# EAGLE design 6-30-10-9:32 (EAGLE 5.06)
AUTHOR: Josh Ashby; VERSION: 1.1
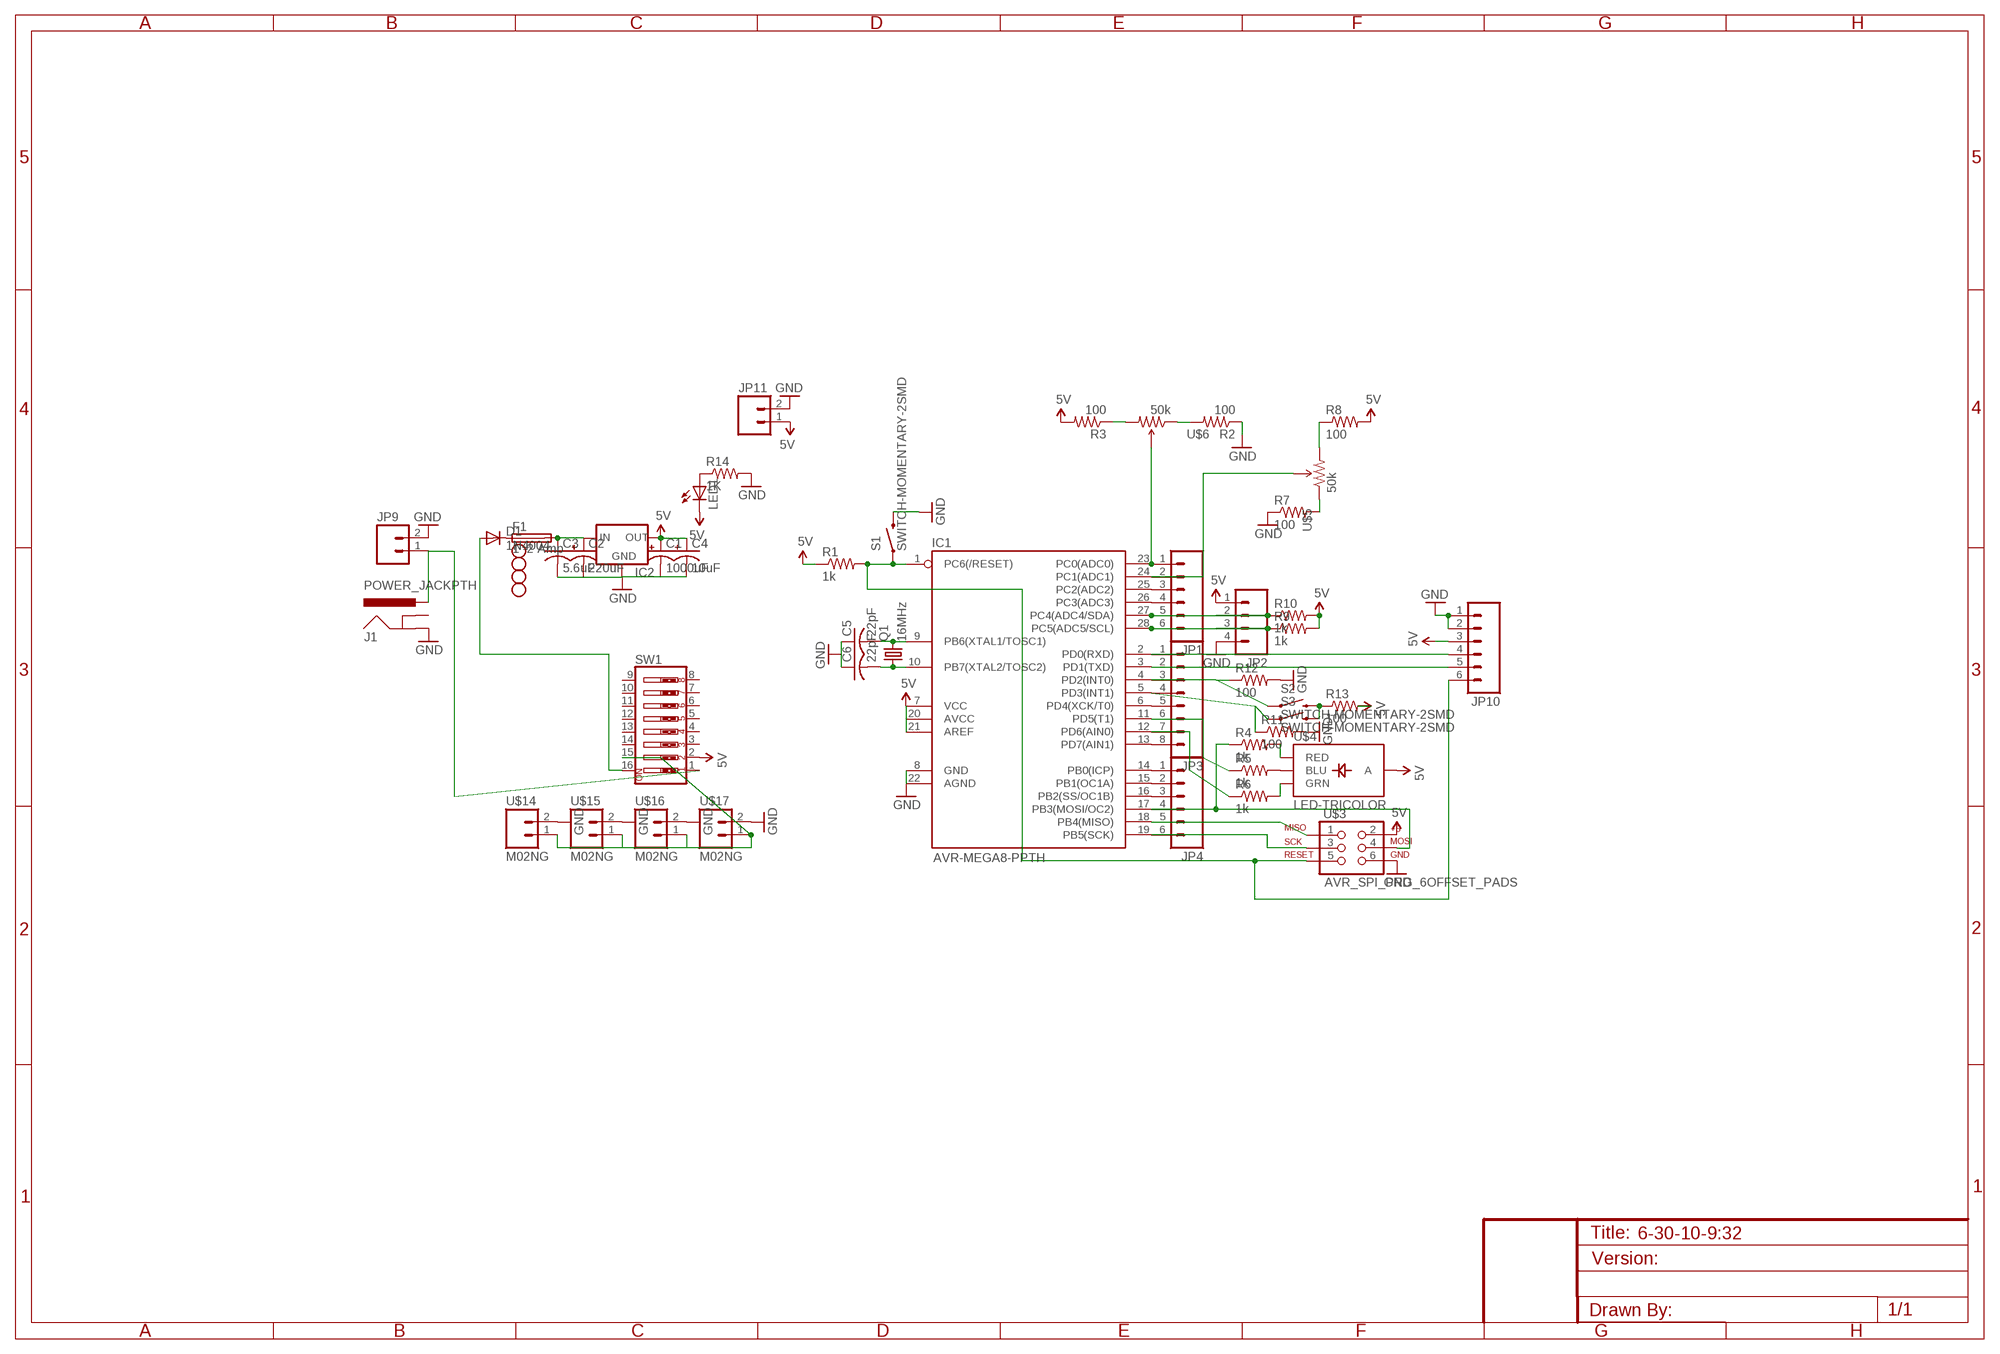
[diagram p0: schematic, sheet 1]

## Parts
C1  1000uF  CPOL-USE2.5-7  [E2,5-7]
C2  220uF  CPOL-USE5-10.5  [E5-10,5]
C3  5.6uF  C-US050-030X075  [C050-030X075]
C4  10uF  CPOL-USE2.5-5  [E2,5-5]
C5  22pF  C-US025-040X050  [C025-040X050]
C6  22pF  C-US025-040X050  [C025-040X050]
D1  1N4004  [DO41-10]
F1  1 -2 Amp  GSH15  [GSH15]
IC1  AVR-MEGA8-PPTH  [DIL28-3]
IC2  V_REG_78XXSIDE  [78XXL]
J1  POWER_JACKPTH  [POWER_JACK_PTH]
JP1  M06LOCK_LONGPADS  [1X06_LOCK_LONGPADS]
JP2  M04LOCK_LONGPADS  [1X04_LOCK_LONGPADS]
JP3  M08LOCK_LONGPADS  [1X08_LOCK_LONGPADS]
JP4  M06LOCK_LONGPADS  [1X06_LOCK_LONGPADS]
JP5  STAND-OFF  [STAND-OFF]
JP6  STAND-OFF  [STAND-OFF]
JP7  STAND-OFF  [STAND-OFF]
JP8  STAND-OFF  [STAND-OFF]
JP9  M025MM  [SCREWTERMINAL-5MM-2]
JP10  M06LOCK_LONGPADS  [1X06_LOCK_LONGPADS]
JP11  M025MM  [SCREWTERMINAL-5MM-2]
LED1  LED0603  [LED-0603]
Q1  16MHz  CRYSTALHC49UV  [HC49U-V]
R1  1k  RESISTOR0603-RES  [0603-RES]
R2  100  RESISTOR0603-RES  [0603-RES]
R3  100  RESISTOR0603-RES  [0603-RES]
R4  1k  RESISTOR0603-RES  [0603-RES]
R5  1k  RESISTOR0603-RES  [0603-RES]
R6  1k  RESISTOR0603-RES  [0603-RES]
R7  100  RESISTOR0603-RES  [0603-RES]
R8  100  RESISTOR0603-RES  [0603-RES]
R9  1k  RESISTOR0603-RES  [0603-RES]
R10  1k  RESISTOR0603-RES  [0603-RES]
R11  100  RESISTOR0603-RES  [0603-RES]
R12  100  RESISTOR0603-RES  [0603-RES]
R13  100  RESISTOR0603-RES  [0603-RES]
R14  1K  RESISTOR0603-RES  [0603-RES]
S1  SWITCH-MOMENTARY-2SMD  [TACTILE_SWITCH_SMD]
S2  SWITCH-MOMENTARY-2SMD  [TACTILE_SWITCH_SMD]
S3  SWITCH-MOMENTARY-2SMD  [TACTILE_SWITCH_SMD]
SW1  SW_DIP-8  [DIPSWITCH-08]
U$3  AVR_SPI_PRG_6OFFSET_PADS  [2X3_OFFSET]
U$4  LED-TRICOLOR  [LED-TRICOLOR-SMD]
U$5  50k  TRIMPOTTRIMPOT_PTH_S3_LOCK  [TRIMPOT_PTH_S3_LOCK]
U$6  50k  TRIMPOTTRIMPOT_PTH_S3_LOCK  [TRIMPOT_PTH_S3_LOCK]
U$14  M02NG  [1X02]
U$15  M02NG  [1X02]
U$16  M02NG  [1X02]
U$17  M02NG  [1X02]

## Nets
5V: C1.+ C4.+ IC1.7(VCC) IC1.20(AVCC) IC1.21(AREF) IC2.OUT JP2.1 JP10.3 JP11.1 LED1.C R1.1 R3.2 R8.2 R9.2 R10.2 R13.2 SW1.2 U$3.2 U$4.A
GND: C1.- C2.- C3.2 C4.- C5.1 C6.1 IC1.8(GND) IC1.22(AGND) IC2.GND J1.GND JP2.4 JP9.2 JP10.1 JP10.2 JP11.2 R2.1 R7.1 R11.2 R12.2 R14.2 S1.3 U$3.6 U$14.2 U$15.2 U$16.2 U$17.2
N$1: R5.2 U$4.B(BLU)
N$2: R6.2 U$4.G(GRN)
N$3: IC1.23(PC0(ADC0)) JP1.1 U$6.2(WIPER)
N$4: IC1.24(PC1(ADC1)) JP1.2 U$5.2(WIPER)
N$5: IC1.25(PC2(ADC2)) JP1.3
N$6: IC1.26(PC3(ADC3)) JP1.4
N$7: IC1.27(PC4(ADC4/SDA)) JP1.5 JP2.2 R10.1
N$8: IC1.28(PC5(ADC5/SCL)) JP1.6 JP2.3 R9.1
N$9: IC1.2(PD0(RXD)) JP3.1 JP10.4
N$10: IC1.3(PD1(TXD)) JP3.2 JP10.5
N$11: IC1.4(PD2(INT0)) JP3.3 R12.1 S2.1
N$12: IC1.5(PD3(INT1)) JP3.4 R11.1 S3.1
N$13: IC1.6(PD4(XCK/T0)) JP3.5
N$14: IC1.11(PD5(T1)) JP3.6 R5.1
N$15: IC1.12(PD6(AIN0)) JP3.7 R6.1
N$16: IC1.13(PD7(AIN1)) JP3.8
N$17: IC1.14(PB0(ICP)) JP4.1
N$18: IC1.15(PB1(OC1A)) JP4.2
N$19: IC1.16(PB2(SS/OC1B)) JP4.3
N$20: IC1.17(PB3(MOSI/OC2)) JP4.4 R4.1 U$3.4
N$21: IC1.18(PB4(MISO)) JP4.5 U$3.1
N$22: IC1.19(PB5(SCK)) JP4.6 U$3.3
N$23: IC1.1(PC6(/RESET)) JP10.6 R1.2 S1.1 U$3.5
N$24: R4.2 U$4.R(RED)
N$25: C6.2 IC1.10(PB7(XTAL2/TOSC2)) Q1.1
N$26: R2.2 U$6.1(CCW)
N$27: R3.1 U$6.3(CW)
N$28: R7.2 U$5.1(CCW)
N$29: R8.1 U$5.3(CW)
N$30: C5.2 IC1.9(PB6(XTAL1/TOSC1)) Q1.2
N$31: R13.1 S2.3 S3.3
N$32: C2.+ C3.1 F1.2 IC2.IN
N$33: J1.PWR JP9.1 SW1.1
N$34: D1.C F1.1
N$35: D1.A SW1.16
N$36: LED1.A R14.1
N$37: SW1.15 U$14.1 U$15.1 U$16.1 U$17.1
Unconnected: J1.GNDBREAK SW1.3 SW1.4 SW1.5 SW1.6 SW1.7 SW1.8 SW1.9 SW1.10 SW1.11 SW1.12 SW1.13 SW1.14

## Library data of the parts
C1 C2 C4 = rcl:CPOL-US: POLARIZED CAPACITOR, American symbol
C3 C5 C6 = rcl:C-US: CAPACITOR, American symbol
D1 = diode:1N4004: DIODE general purpose rectifier, 1 A
F1 = fuse:GSH15: FUSE HOLDER grid 15mm, 19649 Wickmann
IC1 = SparkFun:AVR-MEGA8-P: MICROCONTROLLER 8 Kbytes FLASH 1 kbytes SRAM 512 bytes EEPROM USART 4-channel 10 bit ADC 2-channel 8 bit ADC
IC2 = SparkFun:V_REG_78XX: Voltage Regulator Standard 7805 5V regulator. IGO (Input Ground Output). Spark Fun Electronics SKU : COM-00107
J1 = SparkFun:POWER_JACK: Power Jack This is the standard 5.5mm barrel jack for power. The PTH is the most common, proven, reliable, footprint. All others are experimental. The Slot footprint only works if the mill layer is transmitted to the PCB fab house so be warned. Spark Fun Electronics SKU : PRT-00119. Mating wall wart : TOL-00298 (and others)
JP1 JP4 JP10 = SparkFun:M06: Header 6 Standard 6-pin 0.1" header. Use with straight break away headers (SKU : PRT-00116), right angle break away headers (PRT-00553), swiss pins (PRT-00743), machine pins (PRT-00117), and female headers (PRT-00115). Molex polarized connector foot print use with SKU : PRT-08094 with associated crimp pins and housings. NOTES ON THE VARIANTS LOCK and LOCK_LONGPADS... This footprint was designed to help hold the alignment of a through-hole component (i.e. 6-pin header) while soldering it into place. You may notice that each hole has been shifted either up or down by 0.005 of an inch from it's more standard position (which is a perfectly straight line). This slight alteration caused the pins (the squares in the middle) to touch the edges of the holes. Because they are alternating, it causes a "brace" to hold the component in place. 0.005 has proven to be the perfect amount of "off-center" position when using our standard breakaway headers. Although looks a little odd when you look at the bare footprint, once you have a header in there, the alteration is very hard to notice. Also, if you push a header all the way into place, it is covered up entirely on the bottom side. This idea of altering the position of holes to aid alignment will be further integrated into the Sparkfun Library for other footprints. It can help hold any component with 3 or more connection pins.
JP2 = SparkFun:M04: Header 4 Standard 4-pin 0.1" header. Use with straight break away headers (SKU : PRT-00116), right angle break away headers (PRT-00553), swiss pins (PRT-00743), machine pins (PRT-00117), and female headers (PRT-00115). Molex polarized connector foot print use with SKU : PRT-08231 with associated crimp pins and housings.
JP3 = SparkFun:M08: Header 8 Standard 8-pin 0.1" header. Use with straight break away headers (SKU : PRT-00116), right angle break away headers (PRT-00553), swiss pins (PRT-00743), machine pins (PRT-00117), and female headers (PRT-00115).
JP5-JP8 = SparkFun:STAND-OFF: Stand Off This is the mechanical footprint for a #4 phillips button head screw. Use the keepout ring to avoid running the screw head into surrounding components. SKU : PRT-00447
JP9 JP11 = SparkFun:M02: Header 2 Standard 2-pin 0.1" header. Use with straight break away headers (SKU : PRT-00116), right angle break away headers (PRT-00553), swiss pins (PRT-00743), machine pins (PRT-00117), and female headers (PRT-00115). Molex polarized connector foot print use with SKU : PRT-08233 with associated crimp pins and housings.
LED1 = SparkFun:LED: LEDs Standard schematic elements and footprints for 5mm, 3mm, 1206, and 0603 sized LEDs. 5mm - Spark Fun Electronics SKU : COM-00529 (and others)
Q1 = SparkFun:CRYSTAL: Crystals Various standard crystals. Proven footprints. Spark Fun Electronics SKU : COM-00534
R1-R14 = SparkFun:RESISTOR: Resistor Basic schematic elements and footprints for 0603, 1206, and PTH 1/10th watt (small) resistors.
S1-S3 = SparkFun:SWITCH-MOMENTARY-2
SW1 = SparkFun:SW_DIP-8: DIP Switch 8 Position Spark Fun Electronics SKU : COM-08034
U$3 = SparkFun:AVR_SPI_PRG_6: AVR ISP 6 Pin This is the reduced ISP connector for AVR programming. Common on Arduino. This footprint will take up less PCB space and can be used with a 10-pin to 6-pin adapter such as SKU: BOB-08508
U$4 = SparkFun:LED-TRICOLOR: Tri-Color LED SMD Proven layout and schematic for triple color LED in SMD package - common anode. Spark Fun Electronics SKU : COM-07844
U$5 U$6 = SparkFun:TRIMPOT
U$14-U$17 = SparkFun:M02NG

## Board
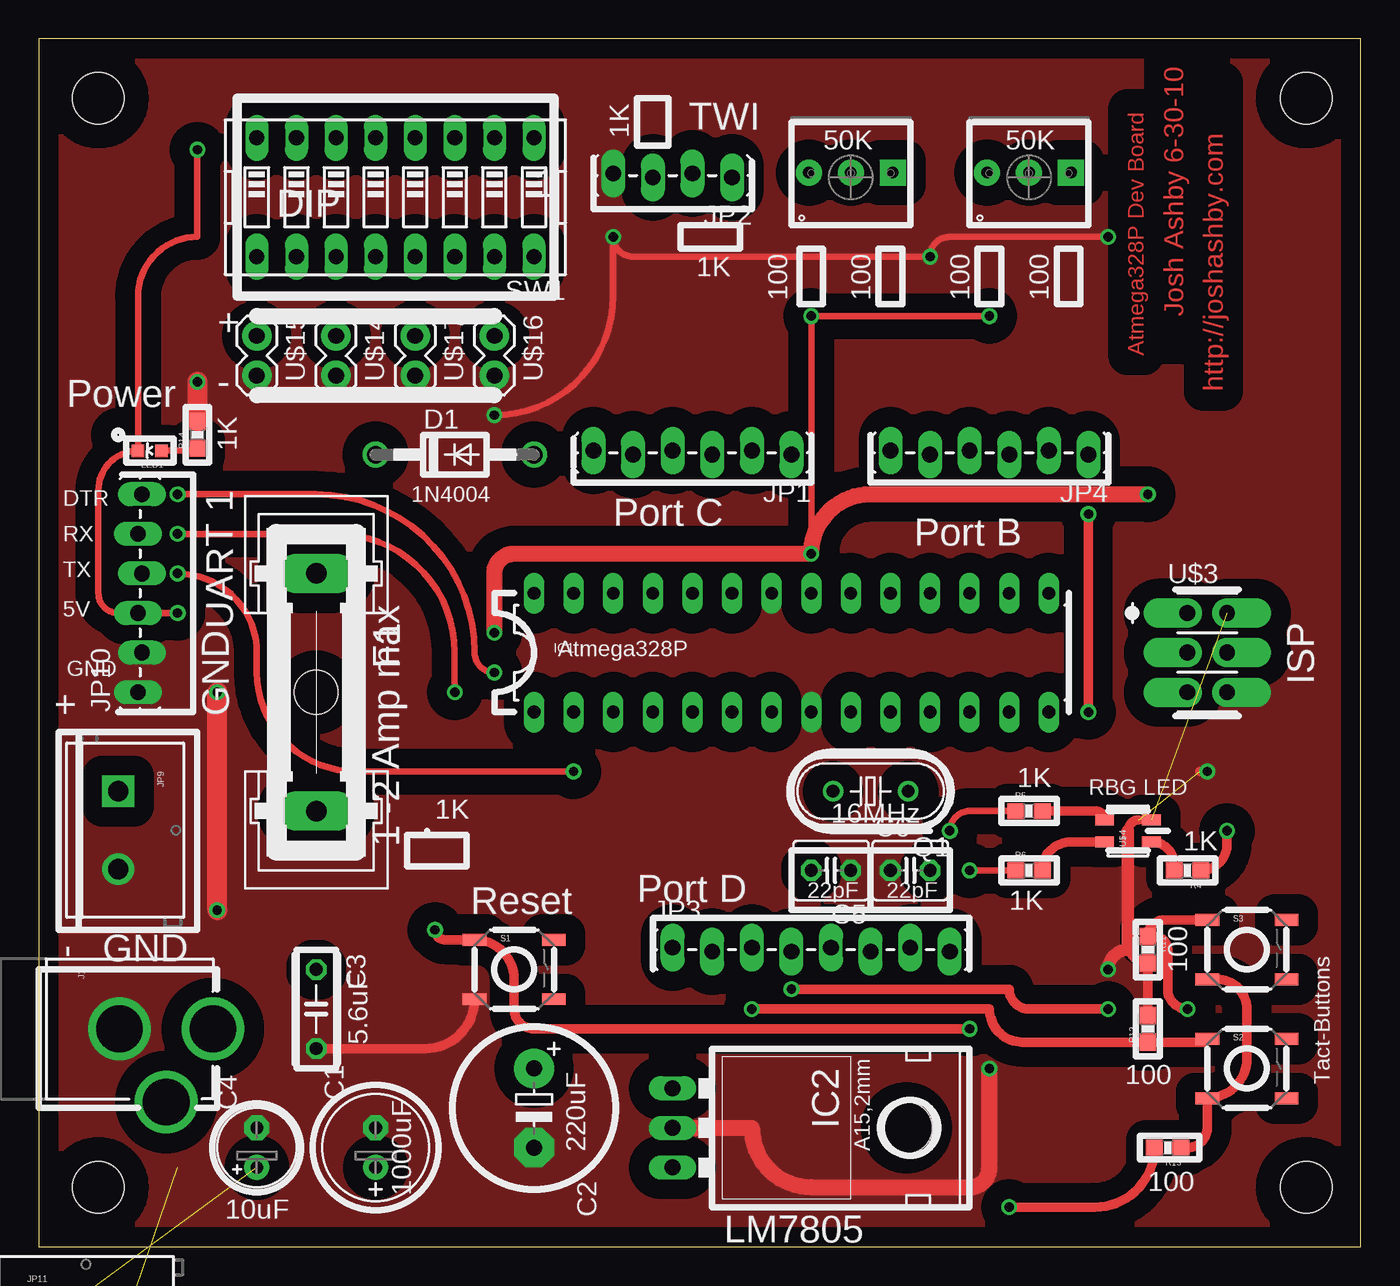
[diagram p1: board, top side]
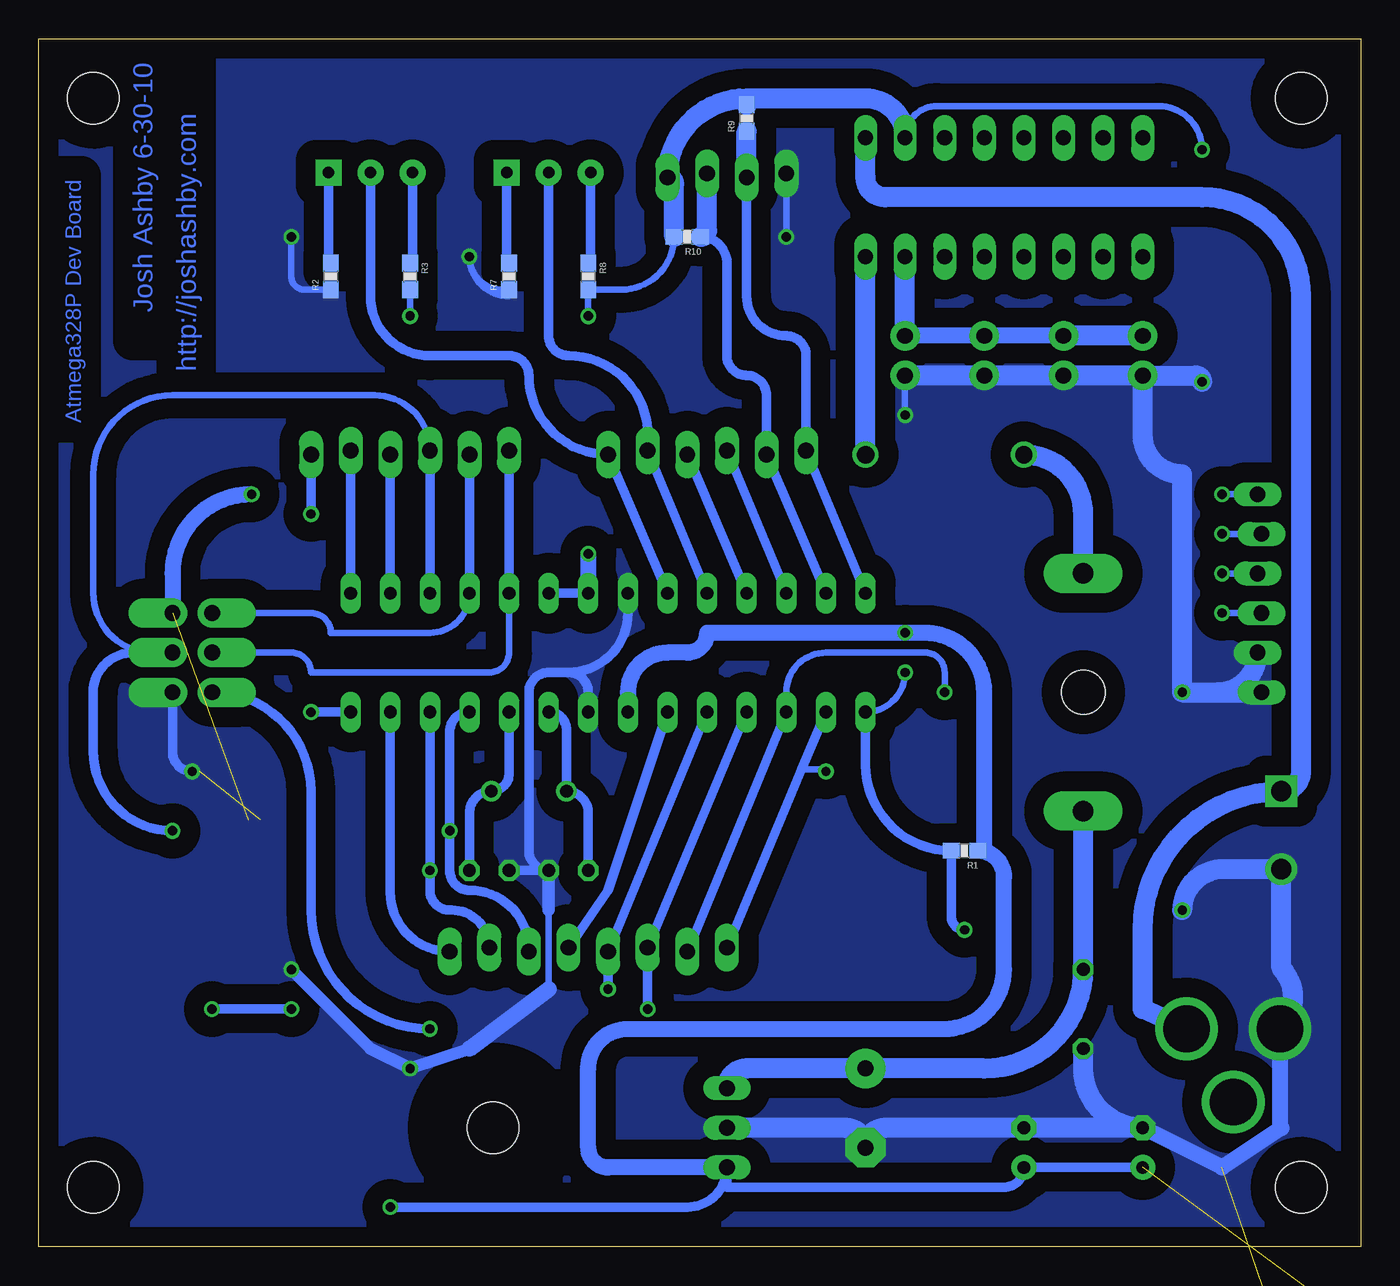
[diagram p2: board, bottom side, seen from below]

Size 84.76 x 77.46 mm. Coordinates in mm from the lower left corner, seen from the top.
Outline: 0,0 84.76,0 84.76,77.46 0,77.46 0,0
Copper layers (1*16): Top 0.035mm / dielectric 1.5mm / Bottom 0.035mm
Design rules "default *": minimum track width 10mil, minimum drill 6mil, track to track 8mil, track to pad 8mil, pad to pad 8mil, via to via 8mil, smd to smd 8mil, copper to edge 40mil, drill to drill 8mil, minimum pad ring 10mil, minimum via ring 8mil, stop-mask expansion 4mil, vias tented up to drill 0mil, thermal gap 10mil

### Footprints (pad centres in the part's own frame; a part is rotated, then mirrored left to right if it is on the bottom)
E2,5-7 = drill 0.813 pad 1.6 round: + -1.27,0 | drill 0.813 pad 1.6 octagon: - 1.27,0
E5-10,5 = drill 1.016 pad 2.54 round: + -2.54,0 | drill 1.016 pad 2.54 octagon: - 2.54,0
C050-030X075 = drill 0.813 octagon: 1 -2.54,0; 2 2.54,0
E2,5-5 = drill 0.813 pad 1.6 round: + -1.27,0 | drill 0.813 pad 1.6 octagon: - 1.27,0
C025-040X050 = drill 0.813 octagon: 1 -1.27,0; 2 1.27,0
DO41-10 = drill 1.118 round: A 5.08,0; C -5.08,0
GSH15 = drill 1.321 pad 2.54 long: 1 -7.62,0; 2 7.62,0 | hole 2.794: 0,0
DIL28-3 = drill 0.813 long: 1 -16.51,-3.81; 2 -13.97,-3.81; 3 -11.43,-3.81; 4 -8.89,-3.81; 5 -6.35,-3.81; 6 -3.81,-3.81; 7 -1.27,-3.81; 8 1.27,-3.81; 9 3.81,-3.81; 10 6.35,-3.81; 11 8.89,-3.81; 12 11.43,-3.81; 13 13.97,-3.81; 14 16.51,-3.81; 15 16.51,3.81; 16 13.97,3.81; 17 11.43,3.81; 18 8.89,3.81; 19 6.35,3.81; 20 3.81,3.81; 21 1.27,3.81; 22 -1.27,3.81; 23 -3.81,3.81; 24 -6.35,3.81; 25 -8.89,3.81; 26 -11.43,3.81; 27 -13.97,3.81; 28 -16.51,3.81
78XXL = drill 1.016 long: GND 0,-3.81; IN -2.54,-3.81; OUT 2.54,-3.81 | hole 3.302: 0,11.176
POWER_JACK_PTH = drill 2.997 round: GND 0,7.7; GNDBREAK 4.7,10.7; PWR 0,13.7
1X06_LOCK_LONGPADS = drill 1.016 long: 1 0,0; 2 2.54,-0.254; 3 5.08,0; 4 7.62,-0.254; 5 10.16,0; 6 12.7,-0.254
1X04_LOCK_LONGPADS = drill 1.016 long: 1 0,0; 2 2.54,-0.254; 3 5.08,0; 4 7.62,-0.254
1X08_LOCK_LONGPADS = drill 1.016 long: 1 0,0.127; 2 2.54,-0.127; 3 5.08,0.127; 4 7.62,-0.127; 5 10.16,0.127; 6 12.7,-0.127; 7 15.24,0.127; 8 17.78,-0.127
STAND-OFF = hole 3.302: 0,0
SCREWTERMINAL-5MM-2 = drill 1.3 pad 2.032 square: 1 0,0 | drill 1.3 pad 2.032 round: 2 5,0
LED-0603 = smd 0.8 x 0.8: A 0,-0.75; C 0,0.75
HC49U-V = drill 0.813 round: 1 -2.413,0; 2 2.413,0
0603-RES = smd 1.1 x 1: 1 -0.85,0; 2 0.85,0
TACTILE_SWITCH_SMD = smd 1.524 x 0.762: 1 -2.54,1.905; 2 2.54,1.905; 3 -2.54,-1.905; 4 2.54,-1.905
DIPSWITCH-08 = drill 0.97 long: 1 -8.89,-3.81; 2 -6.35,-3.81; 3 -3.81,-3.81; 4 -1.27,-3.81; 5 1.27,-3.81; 6 3.81,-3.81; 7 6.35,-3.81; 8 8.89,-3.81; 9 8.89,3.81; 10 6.35,3.81; 11 3.81,3.81; 12 1.27,3.81; 13 -1.27,3.81; 14 -3.81,3.81; 15 -6.35,3.81; 16 -8.89,3.81
2X3_OFFSET = drill 1.016 pad 1.88 offset: 1 0,0; 2 0,2.54; 3 2.54,0; 4 2.54,2.54; 5 5.08,0; 6 5.08,2.54
LED-TRICOLOR-SMD = smd 0.7 x 1.2: A 0.7,-1.5; B 0.7,1.5; G -0.7,1.5; R -0.7,-1.5
TRIMPOT_PTH_S3_LOCK = drill 0.737 pad 1.676 square: 1 -2.692,-0.305 | drill 0.737 pad 1.676 round: 2 0,-0.305; 3 2.692,-0.305
1X02 = drill 1.016 pad 1.88 round: 1 0,0; 2 2.54,0

### Placement (x,y rotation side)
C1  21.59,6.35 90 top
C2  31.75,8.89 270 top
C3  17.78,15.24 270 top
C4  13.97,6.35 90 top
C5  50.8,24.13 180 top
C6  55.88,24.13 0 top
D1  26.67,50.8 0 top
F1  17.78,35.56 270 top
IC1  48.26,38.1 0 top
IC2  44.45,7.62 270 top
J1  -2.54,13.97 270 top
JP1  48.26,50.8 180 top
JP2  44.45,68.58 180 top
JP3  40.64,19.05 0 top
JP4  67.31,50.8 180 top
JP5  81.28,3.81 0 top
JP6  3.81,73.66 0 top
JP7  3.81,3.81 0 top
JP8  81.28,73.66 0 top
JP9  5.08,29.21 270 top
JP10  6.35,35.56 90 top
JP11  0.51,-4.83 0 top  (outside the outline)
LED1  7.11,51.05 90 top
Q1  53.34,29.21 180 top
R1  25.4,25.4 180 bottom
R2  66.04,62.23 90 bottom
R3  60.96,62.23 270 bottom
R4  73.66,24.13 180 top
R5  63.5,27.94 0 top
R6  63.5,24.13 0 top
R7  54.61,62.23 90 bottom
R8  49.53,62.23 270 bottom
R9  39.37,72.39 90 bottom
R10  43.18,64.77 180 bottom
R11  71.12,19.05 270 top
R12  71.12,13.97 90 top
R13  72.39,6.35 180 top
R14  10.16,52.07 90 top
S1  30.48,17.78 0 top
S2  77.47,11.43 0 top
S3  77.47,19.05 0 top
SW1  22.86,67.31 180 top
U$3  73.66,40.64 270 top
U$4  69.85,26.67 90 top
U$5  52.07,68.58 180 top
U$6  63.5,68.58 180 top
U$14  19.05,58.42 270 top
U$15  13.97,58.42 270 top
U$16  29.21,58.42 270 top
U$17  24.13,58.42 270 top

### Tracks (layer width: path | path; a pad name or v marks a point on that pad's centre or on a via)
5V  (via drill 0.6)  (2 unrouted)
  Top 0.406: v49.53,44.45 v49.53,59.69 v60.96,59.69 | v10.16,70.36 10.16,64.77 arc90 6.36,60.97 LED1.C arc90 3.81,48.5 3.81,41.91 arc90 5.08,40.64 v8.89,40.64
  Top 0.61: R13.2 arc-90 67.73,2.54 v62.23,2.54
  Top 1.016: v71.12,48.26 53.34,48.26 arc90 v49.53,44.45 30.48,44.45 arc90 29.21,43.18 v29.21,39.37
  Bottom 0.406: R8.2 v49.53,59.69 R8.2 | v49.53,44.45 IC1.21 | R8.2 47.42,61.38 arc-90 R10.2 | v60.96,59.69 R3.2 | v10.16,70.36 arc-90 12.95,73.15 27.18,73.15 arc-90 SW1.2 | v8.89,40.64 JP10.3
  Bottom 0.61: IC1.21 IC1.20 | v62.23,2.54 43.18,2.54 arc-90 IC2.OUT 40.64,3.81 22.86,3.81 arc-90 C1.+ C4.+
  Bottom 1.016: IC1.7 46.99,35.56 arc90 44.45,38.1 43.18,38.1 arc-90 41.91,39.37 v29.21,39.37 27.94,39.37 arc90 24.13,35.56 24.13,25.82 arc90 R1.1 arc90 22.86,23.71 22.86,17.78 arc90 26.67,13.97 46.99,13.97 arc-90 49.53,11.43 49.53,6.35 arc-90 48.26,5.08 IC2.OUT | U$3.2 76.2,43.18 arc90 v71.12,48.26 | v49.53,44.45 IC1.21
  Bottom 1.27: SW1.2 arc-90 31.75,73.66 39.37,73.66 | 39.37,73.66 arc-90 JP2.1 arc90 44.03,68.16 R10.2 | 39.37,73.66 R9.2
GND  (via drill 0.6)  (2 unrouted)
  Top 0.406: v68.58,64.77 58.42,64.77 arc90 v57.15,63.5 38.1,63.5 arc-90 v36.83,64.77 36.83,60.96 arc-90 v29.21,53.34
  Top 0.61: 70.55,27.37 arc90 69.85,26.67 69.85,19.47 arc90 R11.2 R12.2 | v74.93,30.48 74.46,30.48 | S1.3 arc-90 24.77,12.7 C3.2
  Top 0.813: 69.85,26.67 69.85,19.05 arc90 v68.58,17.78
  Top 1.016: v60.96,11.43 60.96,5.08 arc-90 59.69,3.81 49.53,3.81 arc-90 45.72,7.62 IC2.GND
  Top 1.27: v10.16,55.46 R14.2 | v11.43,21.59 v11.43,35.56
  Bottom 0.406: R2.1 67.73,61.38 arc90 68.58,62.23 v68.58,64.77 | U$16.2 v29.21,53.34 | 52.07,16.51 52.07,21.59 | v57.15,63.5 arc-90 54.61,60.96 R7.1 55.03,61.38 arc90 v57.15,63.5 | v36.83,64.77 JP2.4 v36.83,64.77
  Bottom 0.61: U$3.6 76.2,31.75 arc-90 v74.93,30.48 | C6.1 C5.1 arc90 53.34,25.4 53.34,35.56 arc90 52.07,36.83 50.8,36.83 | 50.8,36.83 arc90 49.53,35.56 IC1.8 | IC1.22 46.99,40.64 arc90 50.8,36.83
  Bottom 0.813: 52.07,21.59 C5.1 | 57.15,12.7 v60.96,11.43 63.5,12.7 v68.58,17.78
  Bottom 1.016: J1.GND 5.16,7.7 arc-90 5.08,7.62 8.89,5.08 C4.- | 57.15,12.7 52.07,16.51
  Bottom 1.27: IC2.GND 33.02,7.62 arc90 C2.- arc90 30.48,7.62 C1.- C4.- arc90 17.78,11.43 C3.2 | J1.GND arc-90 5.08,17.86 JP9.2 8.81,24.21 arc-90 v11.43,21.59 | U$15.2 U$14.2 U$17.2 U$16.2 | U$15.2 10.58,55.88 arc90 v10.16,55.46 | v11.43,35.56 JP10.1 v11.43,35.56 | 9.14,35.56 arc-90 JP10.2 arc90 9.14,35.56 | v11.43,35.56 9.14,35.56 | v11.43,35.56 11.43,49.53 arc90 13.97,52.07 U$15.2
  pour Bottom (isolate 1.27, no thermals): 0,77.47 85.09,77.47 85.09,0 0,0
  pour Top (isolate 1.27, no thermals): 0,77.47 85.09,77.47 85.09,0 0,0
N$1
  Top 0.61: U$4.B arc90 67.78,27.94 R5.2
N$2
  Top 0.61: R6.2 arc-90 66.19,25.97 U$4.G
N$3
  Bottom 0.61: U$6.2 63.5,60.96 arc-90 59.69,57.15 54.61,57.15 arc90 53.34,55.88 arc-90 JP1.1 IC1.23
N$4
  Bottom 0.61: U$5.2 52.07,58.42 arc-90 50.8,57.15 arc90 45.72,52.07 JP1.2 IC1.24
N$5
  Bottom 0.61: IC1.25 JP1.3
N$6
  Bottom 0.61: IC1.26 JP1.4
N$7
  Bottom 0.61: R10.1 arc90 40.64,63.08 40.64,57.15 arc-90 39.37,55.88 arc90 38.1,54.61 JP1.5 IC1.27
  Bottom 1.27: JP2.2 41.91,65.19 arc90 R10.1
N$8
  Bottom 0.61: JP2.3 39.37,60.96 arc-90 36.83,58.42 arc90 35.56,57.15 JP1.6 IC1.28
  Bottom 1.27: JP2.3 R9.1
N$9  (via drill 0.6)
  Top 0.406: v34.29,30.48 20.32,30.48 arc-90 13.97,36.83 13.97,38.1 arc90 v8.89,43.18
  Bottom 0.406: v34.29,30.48 arc-90 34.41,30.6 35.84,30.6 | JP10.4 v8.89,43.18
  Bottom 0.61: JP3.1 35.84,30.6 IC1.2
N$10  (via drill 0.6)
  Top 0.406: v8.89,45.72 19.05,45.72 arc-90 26.67,38.1 v26.67,35.56
  Bottom 0.406: JP10.5 v8.89,45.72 | v26.67,35.56 26.67,36.83 arc-90 27.94,38.1 34.29,38.1 arc-90 36.83,35.56 IC1.3
  Bottom 0.61: IC1.3 JP3.2
N$11  (via drill 0.6)
  Top 0.61: S2.1 arc-90 74.72,13.12 R12.1 63.08,13.12 arc-90 60.96,15.24 v45.72,15.24
  Bottom 0.61: v45.72,15.24 JP3.3 IC1.4
N$12  (via drill 0.6)
  Top 0.61: S3.1 72.17,20.95 arc90 R11.1 71.54,19.9 arc-90 72.39,19.05 72.39,16.51 arc90 v73.66,15.24 | v68.58,15.24 63.5,15.24 arc-90 62.23,16.51 v48.26,16.51
  Bottom 0.61: v68.58,15.24 v73.66,15.24 | v48.26,16.51 JP3.4 IC1.5
N$13
  Bottom 0.61: JP3.5 48.26,22.86 IC1.6
N$14  (via drill 0.6)
  Top 0.406: R5.1 59.69,27.94 arc90 v58.42,26.67
  Bottom 0.61: JP3.6 53.34,19.05 arc-90 57.15,22.86 arc90 58.42,24.13 v58.42,26.67 58.42,33.02 arc90 IC1.11
N$15  (via drill 0.6)
  Top 0.406: v59.69,24.13 R6.1
  Bottom 0.61: IC1.12 v59.69,24.13 59.69,22.86 arc-90 58.42,21.59 58.29,21.59 arc90 JP3.7
N$16
  Bottom 0.61: IC1.13 62.23,22.73 arc-90 JP3.8
N$17  (via drill 0.6)
  Top 0.61: v67.31,34.29 v67.31,46.99
  Bottom 0.61: v67.31,46.99 JP4.1 | IC1.14 v67.31,34.29
N$18
  Bottom 0.61: IC1.15 JP4.2
N$19
  Bottom 0.61: IC1.16 JP4.3
N$20  (via drill 0.6)
  Top 0.61: R4.1 arc90 76.2,25.82 v76.2,26.67
  Bottom 0.406: U$3.4 77.47,38.1 arc90 81.28,41.91 81.28,49.53 arc90 76.2,54.61 63.25,54.61 arc90 JP4.4
  Bottom 0.61: JP4.4 IC1.17 | v76.2,26.67 arc90 81.28,31.75 81.28,35.56 arc90 78.74,38.1 U$3.4
N$21
  Bottom 0.406: U$3.1 67.31,40.64 arc90 66.04,39.37 59.69,39.37 arc-90 IC1.18
  Bottom 0.61: IC1.18 JP4.5
N$22
  Bottom 0.406: U$3.3 68.58,38.1 arc90 67.31,36.83 55.88,36.83 arc-90 54.61,38.1 IC1.19
  Bottom 0.61: IC1.19 JP4.6
N$23  (via drill 0.6)
  Top 0.406: v8.89,48.26 17.78,48.26 arc-90 27.94,38.1 arc90 v29.21,36.83
  Top 0.61: v59.69,13.97 31.75,13.97 arc-90 30.48,15.24 30.48,17.14 arc90 S1.1 26.04,19.68 arc-90 v25.4,20.32
  Bottom 0.406: v8.89,48.26 JP10.6 | IC1.1 arc-90 v29.21,36.83
  Bottom 0.61: U$3.5 arc90 67.31,29.21 67.31,21.59 arc-90 v59.69,13.97 | v25.4,20.32 arc90 26.25,21.17 R1.2 arc90 31.75,30.9 IC1.1
N$24
  Top 0.61: U$4.R arc-90 72.81,24.51 R4.2
N$25
  Bottom 0.61: IC1.10 54.61,30.35 arc90 Q1.1 arc-90 57.15,27.81 C6.2
N$26
  Bottom 0.61: U$6.1 66.19,63.23 arc-90 R2.2
N$27
  Bottom 0.61: R3.1 60.81,63.08 U$6.3
N$28
  Bottom 0.61: U$5.1 54.76,63.23 arc-90 R7.2
N$29
  Bottom 0.61: U$5.3 49.38,63.23 arc90 R8.1
N$30
  Bottom 0.61: IC1.9 arc90 50.93,33.15 Q1.2 arc90 49.53,27.81 C5.2
N$31
  Top 0.61: R13.1 73.66,6.35 arc90 74.93,7.62 S2.3 arc90 77.47,12.06 77.47,15.24 arc90 75.56,17.14 S3.3
N$32
  Bottom 1.27: F1.2 C3.1 arc90 24.13,11.43 C2.+ 39.37,11.43 arc-90 IC2.IN
N$33
  Bottom 1.27: J1.PWR 13.97,15.24 13.97,20.32 arc90 JP9.1 arc-90 3.81,30.48 3.81,60.96 arc-90 10.16,67.31 30.48,67.31 arc90 31.75,68.58 SW1.1
N$34
  Bottom 1.27: D1.C arc90 17.78,46.99 F1.1
N$35
  Bottom 1.27: D1.A SW1.16
N$36
  Top 0.406: LED1.A 10.16,51.05 R14.1
N$37
  Bottom 1.016: U$14.1 U$17.1 U$16.1
  Bottom 1.27: U$15.1 U$14.1 | U$16.1 SW1.15
(copper drawn outside any net)
  shapes: Top circle x1

### Text on the board
Top: Josh Ashby 6-30-10 | Atmega328P Dev Board | http://joshashby.com
Bottom: Josh Ashby 6-30-10 | http://joshashby.com | Atmega328P Dev Board
_tsilk: TWI | 1K | 50K | 50K | 1 | 1 | DIP | 1K | 100 | 100 | 100 | 100 | + | - | Power | 1K | 1N4004 | DTR | Port C | RX | Port B | TX | 5V | UART 1 | Atmega328P | GND | ISP | + | GND | 1K | RBG LED | 1K | 16MHz | 1 -2 Amp max | 1K | Port D | 22pF | 22pF | 1K | Reset | 100 | - | GND | 5.6uF | 100 | Tact-Buttons | 220uF | 100 | 1000uF | 10uF | LM7805